# EasyEDA Pro project ProPrj_PomoDesk_V1.0.epro, schematic Schematic1_1

## Sheets
1 MAIN: Board Name: Board_USB_Only; Create Date: 2025-09-04; Page Name: MAIN; Project Name: Pomodoro_desk; Schematic Name: Schematic1_1; Update Date: 2026-05-01; Company: EasyEDA.com; Page Size: A4; Version: V1.0
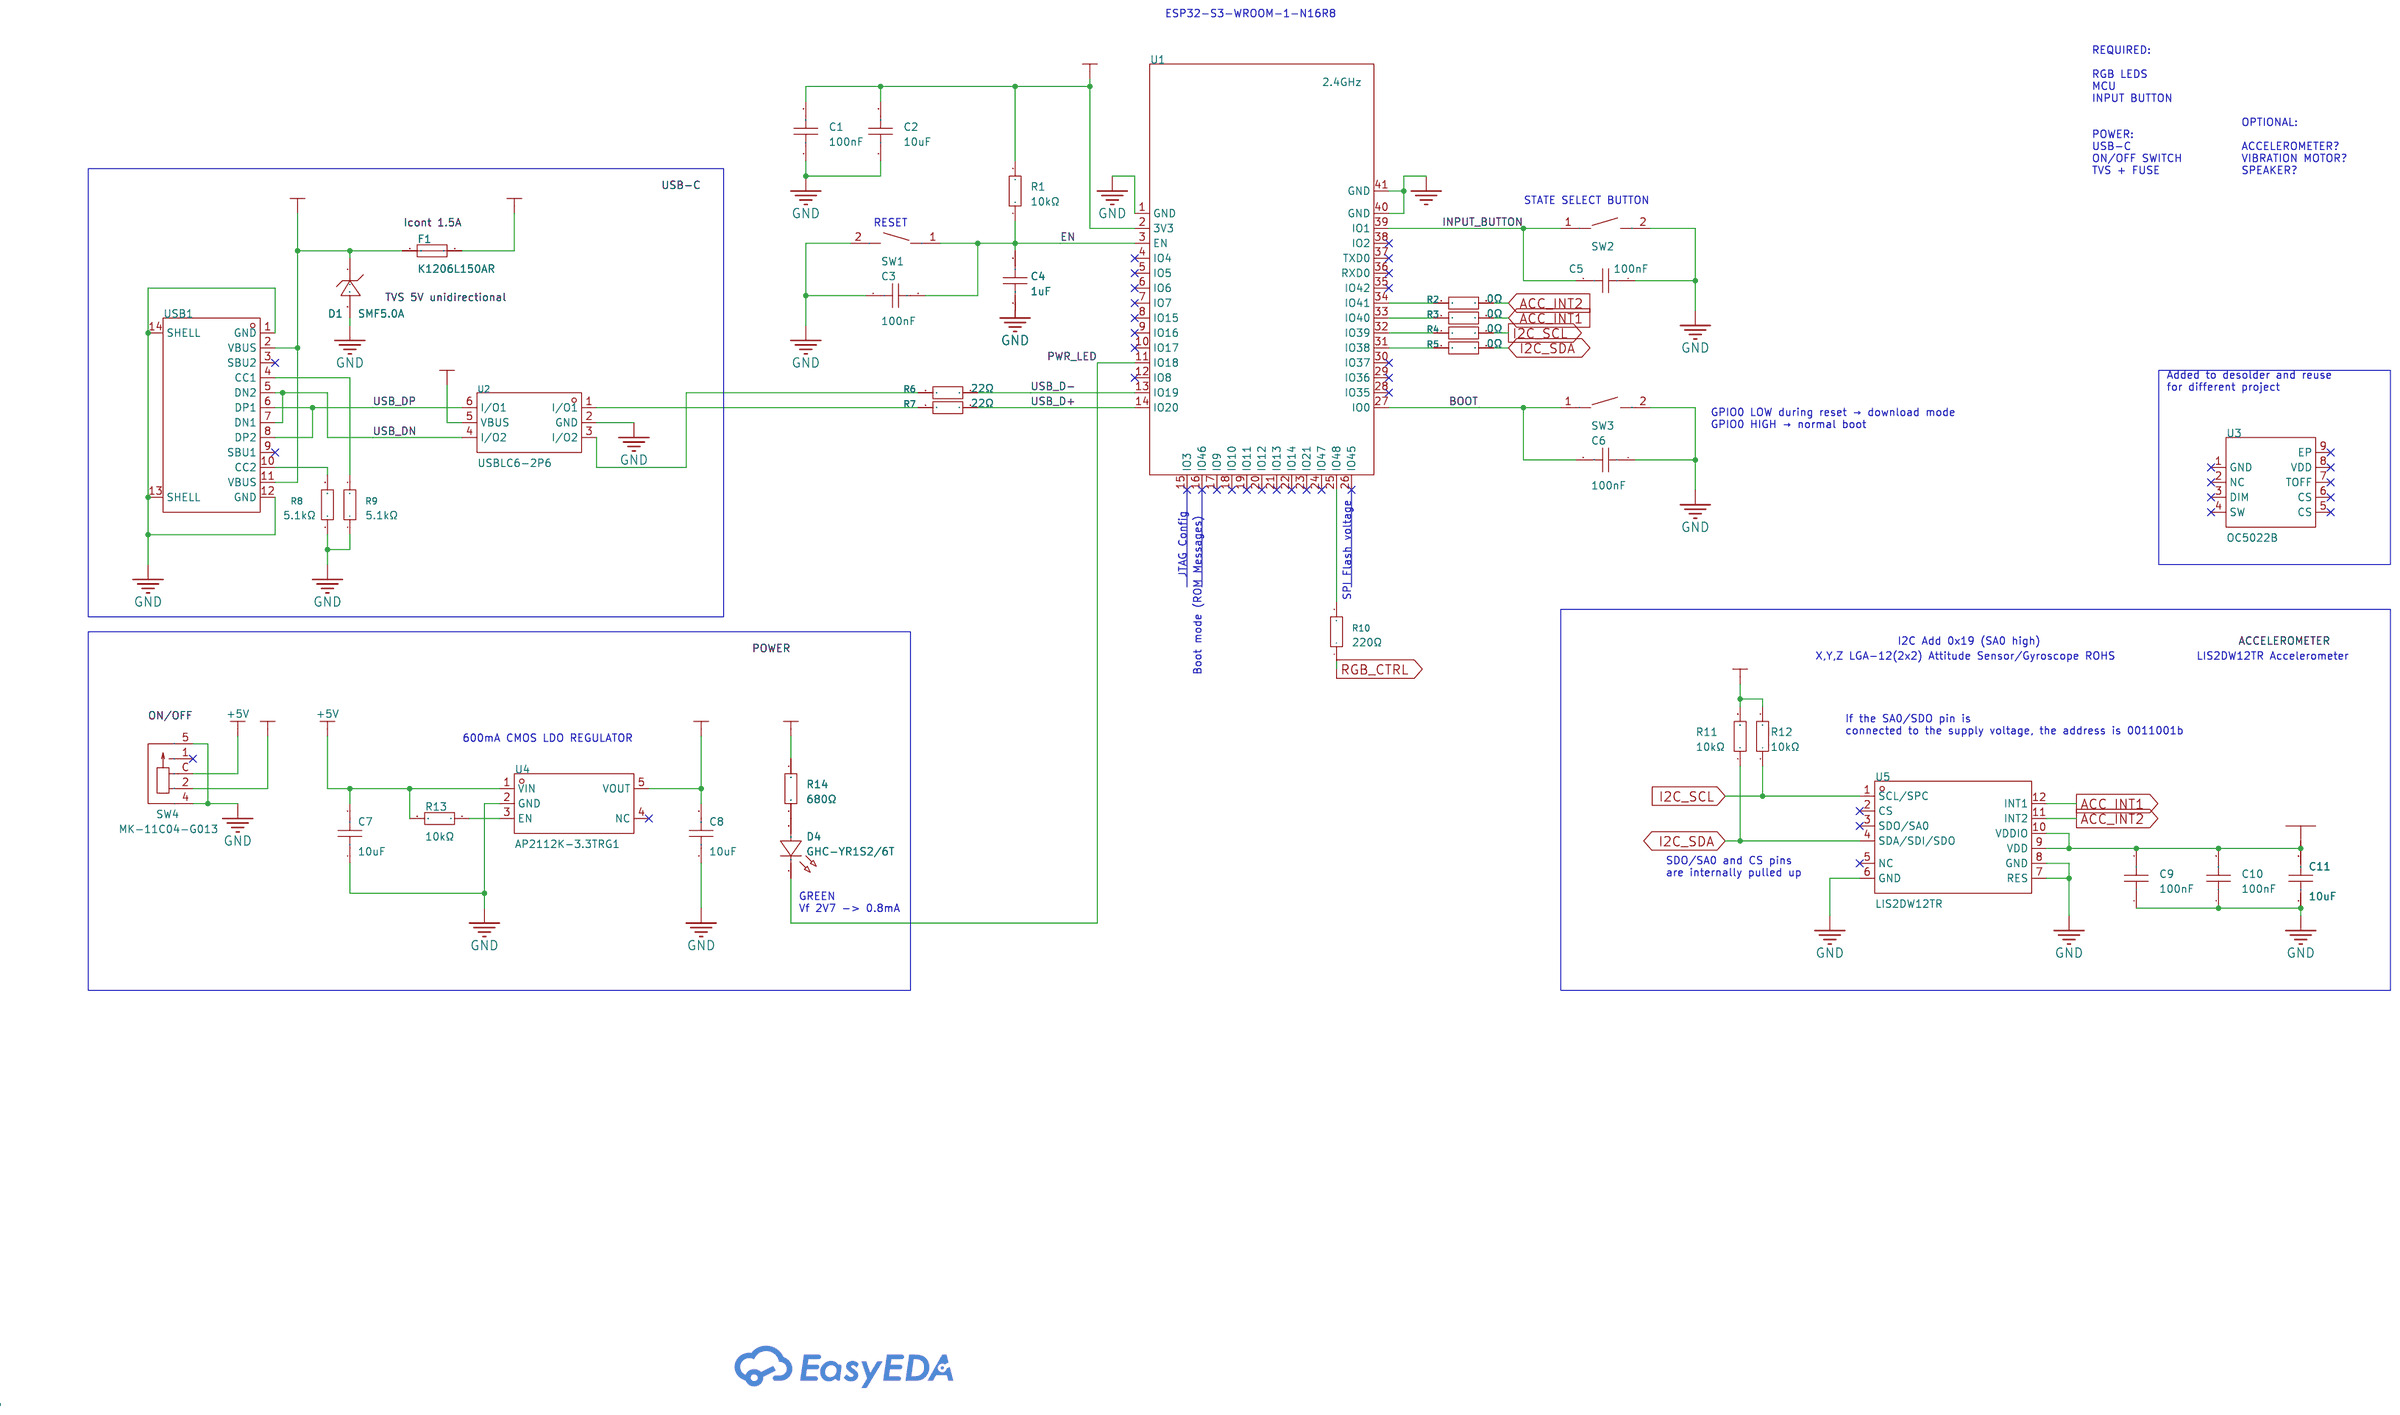
[diagram p3: MAIN]
2 LEDS: Page Name: LEDS; Update Date: 2026-04-30
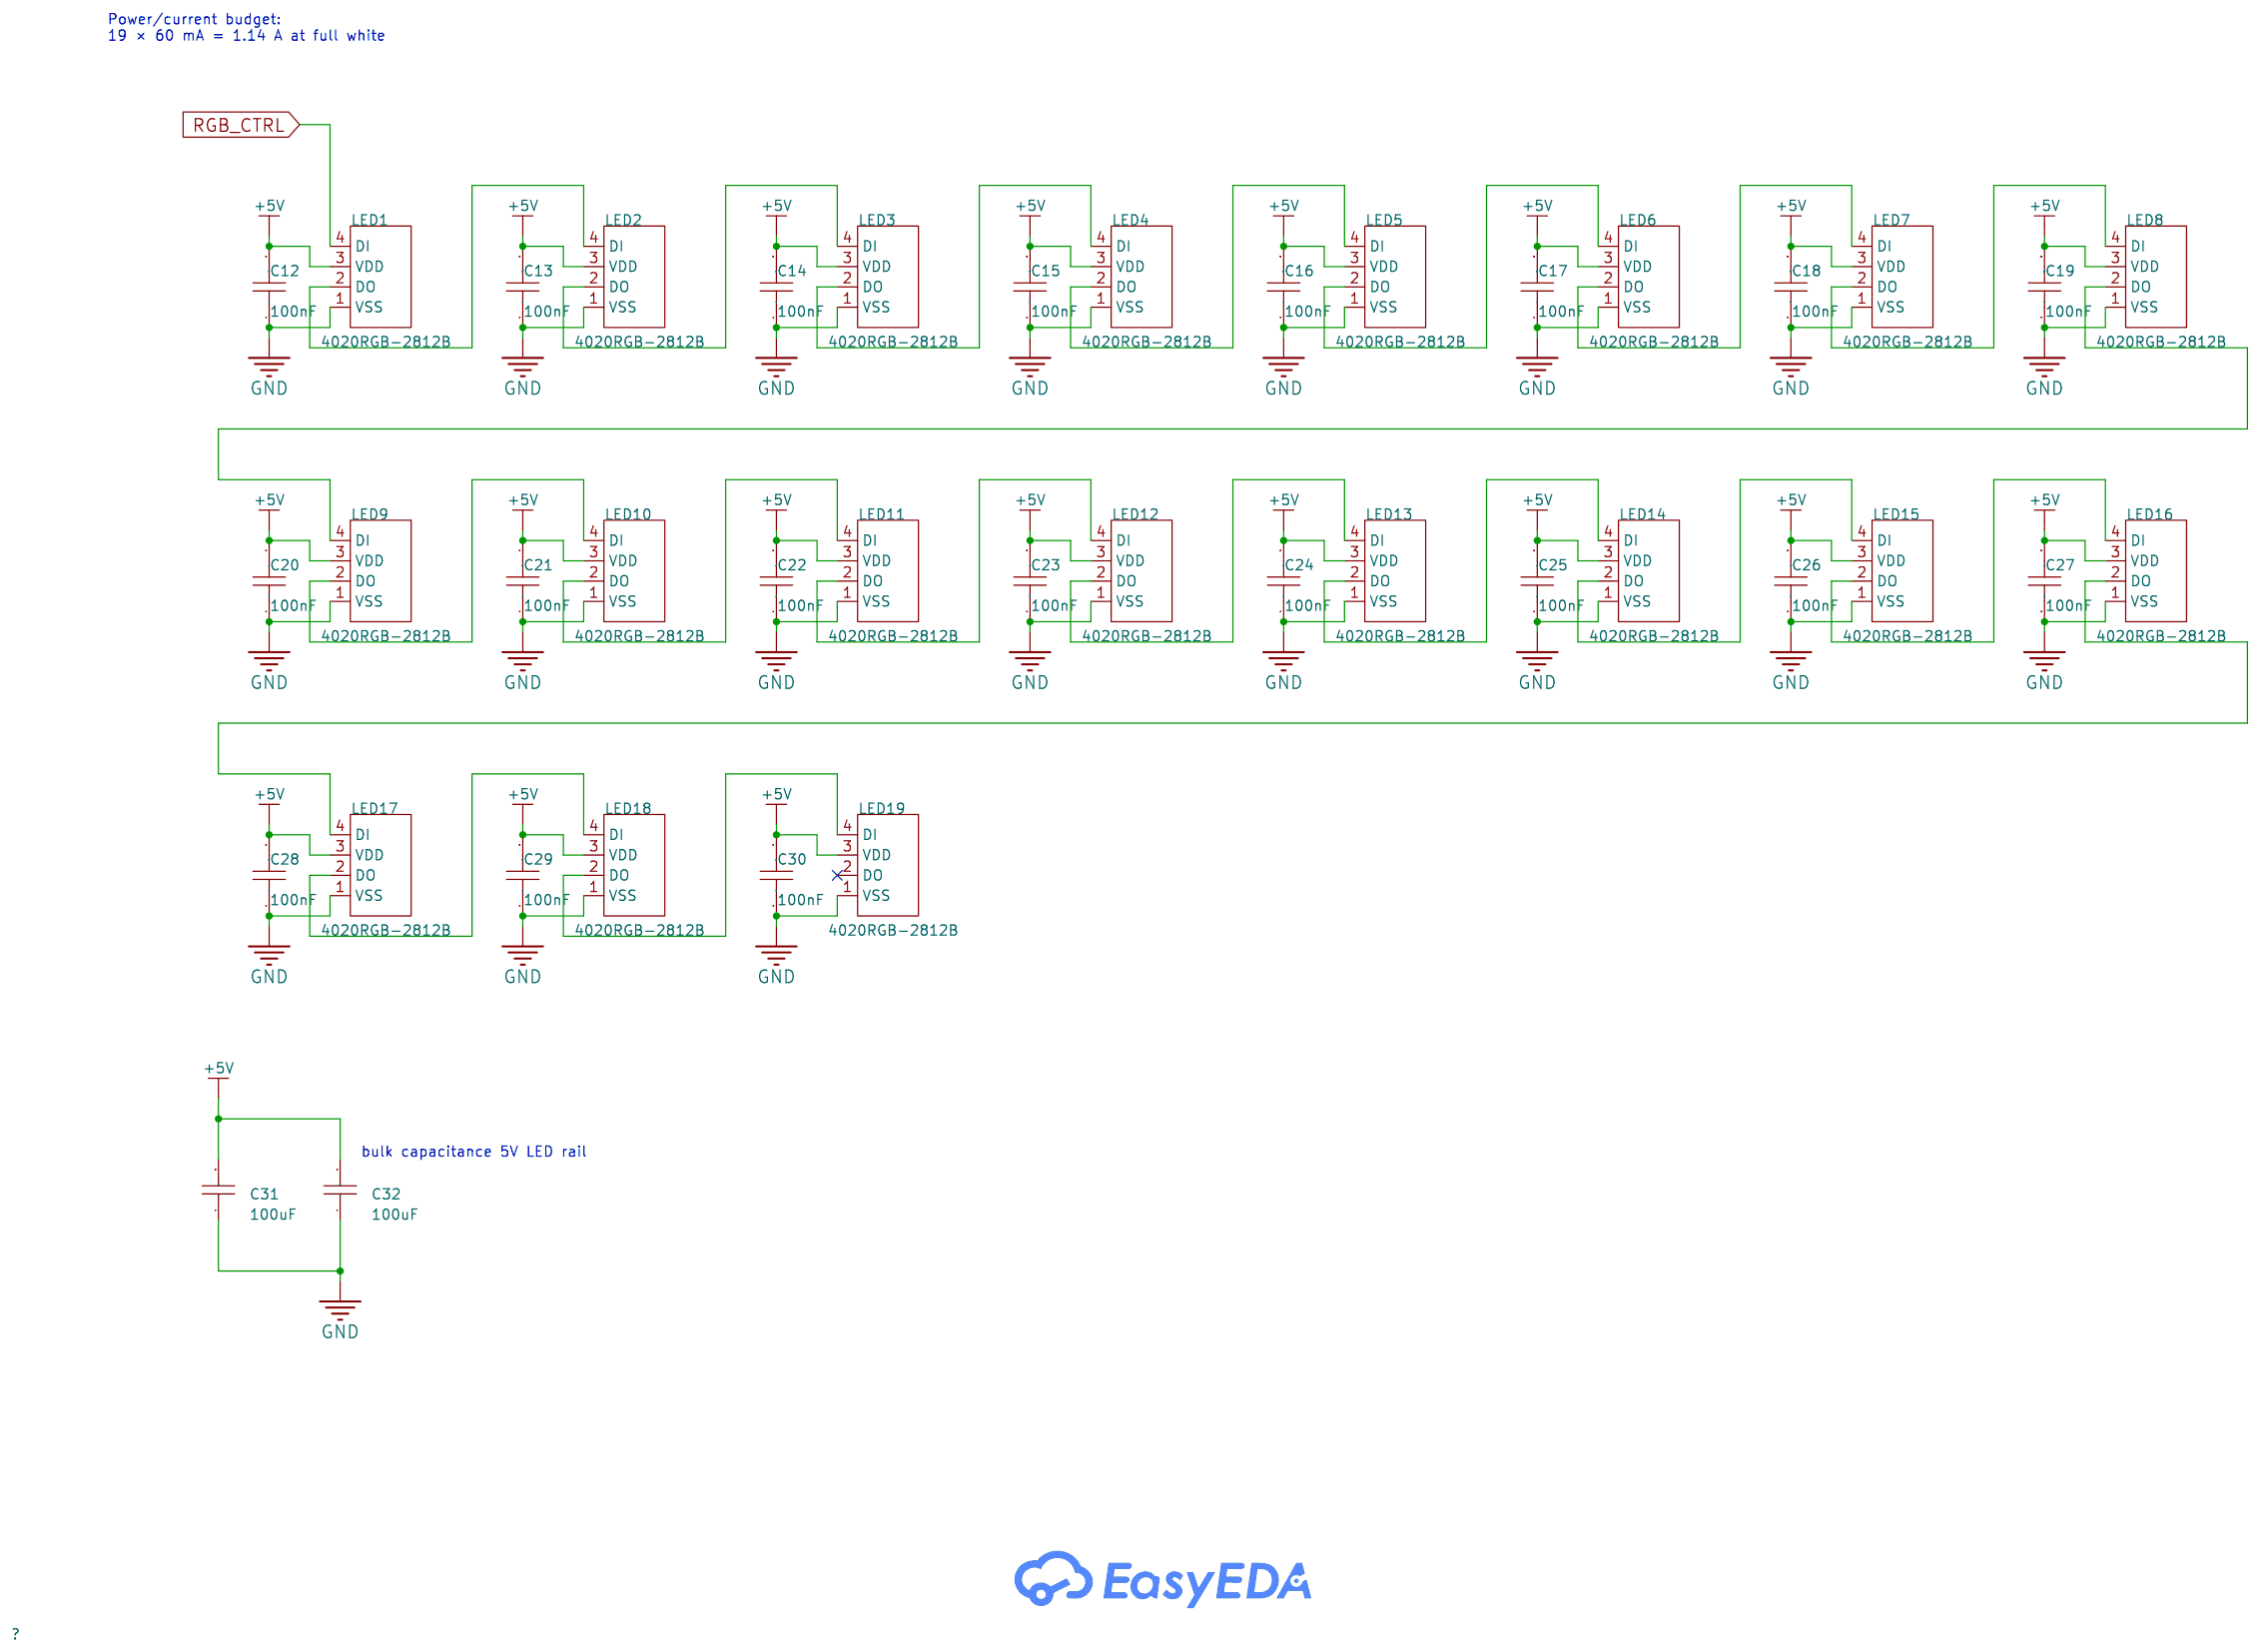
[diagram p4: LEDS]

## Parts
sheet LEDS
C12  100nF  [C0402]
C13  100nF  [C0402]
C14  100nF  [C0402]
C15  100nF  [C0402]
C16  100nF  [C0402]
C17  100nF  [C0402]
C18  100nF  [C0402]
C19  100nF  [C0402]
C20  100nF  [C0402]
C21  100nF  [C0402]
C22  100nF  [C0402]
C23  100nF  [C0402]
C24  100nF  [C0402]
C25  100nF  [C0402]
C26  100nF  [C0402]
C27  100nF  [C0402]
C28  100nF  [C0402]
C29  100nF  [C0402]
C30  100nF  [C0402]
C31  100uF  [C1206]
C32  100uF  [C1206]
LED1  4020RGB-2812B  [LED-SMD_4P-L4.0-W1.7_XL-4020RGBC-WS2812B]
LED2  4020RGB-2812B  [LED-SMD_4P-L4.0-W1.7_XL-4020RGBC-WS2812B]
LED3  4020RGB-2812B  [LED-SMD_4P-L4.0-W1.7_XL-4020RGBC-WS2812B]
LED4  4020RGB-2812B  [LED-SMD_4P-L4.0-W1.7_XL-4020RGBC-WS2812B]
LED5  4020RGB-2812B  [LED-SMD_4P-L4.0-W1.7_XL-4020RGBC-WS2812B]
LED6  4020RGB-2812B  [LED-SMD_4P-L4.0-W1.7_XL-4020RGBC-WS2812B]
LED7  4020RGB-2812B  [LED-SMD_4P-L4.0-W1.7_XL-4020RGBC-WS2812B]
LED8  4020RGB-2812B  [LED-SMD_4P-L4.0-W1.7_XL-4020RGBC-WS2812B]
LED9  4020RGB-2812B  [LED-SMD_4P-L4.0-W1.7_XL-4020RGBC-WS2812B]
LED10  4020RGB-2812B  [LED-SMD_4P-L4.0-W1.7_XL-4020RGBC-WS2812B]
LED11  4020RGB-2812B  [LED-SMD_4P-L4.0-W1.7_XL-4020RGBC-WS2812B]
LED12  4020RGB-2812B  [LED-SMD_4P-L4.0-W1.7_XL-4020RGBC-WS2812B]
LED13  4020RGB-2812B  [LED-SMD_4P-L4.0-W1.7_XL-4020RGBC-WS2812B]
LED14  4020RGB-2812B  [LED-SMD_4P-L4.0-W1.7_XL-4020RGBC-WS2812B]
LED15  4020RGB-2812B  [LED-SMD_4P-L4.0-W1.7_XL-4020RGBC-WS2812B]
LED16  4020RGB-2812B  [LED-SMD_4P-L4.0-W1.7_XL-4020RGBC-WS2812B]
LED17  4020RGB-2812B  [LED-SMD_4P-L4.0-W1.7_XL-4020RGBC-WS2812B]
LED18  4020RGB-2812B  [LED-SMD_4P-L4.0-W1.7_XL-4020RGBC-WS2812B]
LED19  4020RGB-2812B  [LED-SMD_4P-L4.0-W1.7_XL-4020RGBC-WS2812B]
sheet MAIN
C1  100nF  [C0402]
C2  10uF  [C0805]
C3  100nF  [C0402]
C4  1uF  [C0603]
C5  100nF  [C0402]
C6  100nF  [C0402]
C7  10uF  [C0805]
C8  10uF  [C0805]
C9  100nF  [C0402]
C10  100nF  [C0402]
C11  10uF  [C0805]
D1  SMF5.0A  [SOD-123F_L2.8-W1.8-LS3.7-RD]
D4  GHC-YR1S2/6T  [LED0603-RD_GREEN]
F1  K1206L150AR  [F1206]
R1  10kΩ  [R0402]
R2  0Ω  [R0402]
R3  0Ω  [R0402]
R4  0Ω  [R0402]
R5  0Ω  [R0402]
R6  22Ω  [R0402]
R7  22Ω  [R0402]
R8  5.1kΩ  [R0402]
R9  5.1kΩ  [R0402]
R10  220Ω  [R0402]
R11  10kΩ  [R0402]
R12  10kΩ  [R0402]
R13  10kΩ  [R0402]
R14  680Ω  [R0402]
SW1  TS-1088-AR02016  [SW-SMD_L3.9-W3.0-P4.45]
SW2  TS-1088-AR02016  [SW-SMD_L3.9-W3.0-P4.45]
SW3  TS-1088-AR02016  [SW-SMD_L3.9-W3.0-P4.45]
SW4  MK-11C04-G013  [SW-SMD_MK-11C04-G013]
U1  2.4GHz  [WIRELM-SMD_ESP32-S3-WROOM-1]
U2  USBLC6-2P6  [SOT-666-6_L1.6-W1.2-P0.50-LS1.6-BL]
U3  OC5022B  [ESOP-8_L4.9-W3.9-P1.27-LS6.0-BL-EP-1]
U4  AP2112K-3.3TRG1  [SOT-25-5_L2.9-W1.6-P0.95-LS2.8-BL]
U5  LIS2DW12TR  [LGA-12_L2.0-W2.0-P0.50-BL]
USB1  TYPE-C 16PIN 2MD(073)  [USB-C-SMD_TYPE-C-6PIN-2MD-073]

## Library data of the parts
C1 C3 C5 C6 C9 C10 C12-C30 = CL05B104KO5NNNC: Capacitance:100nF Tolerance:±10% Tolerance:±10% Voltage Rating:16V Temperature Coefficient:X7R; LCSC Part Name: 100nF ±10% 16V; Supplier Part: C1525; Manufacturer: SAMSUNG(三星); Supplier Footprint: 0402; JLCPCB Part Class: Basic Part; Datasheet: https://item.szlcsc.com/datasheet/CL05B104KO5NNNC/1877.html; Supplier: LCSC; Tolerance: ±10%; Voltage Rating: 16V; Temperature Coefficient: X7R
C31 C32 = CL31A107MQHNNNE: Capacitance:100uF Tolerance:±20% Tolerance:±20% Voltage Rating:6.3V Temperature Coefficient:X5R; LCSC Part Name: 100uF ±20% 6.3V; Supplier Part: C15008; Manufacturer: SAMSUNG(三星); Supplier Footprint: 1206; JLCPCB Part Class: Basic Part; Datasheet: https://item.szlcsc.com/datasheet/CL31A107MQHNNNE/15681.html; Supplier: LCSC; Tolerance: ±20%; Voltage Rating: 6.3V; Temperature Coefficient: X5R
LED1-LED19 = XL-4020RGBC-2812B: Wavelength:B:465nm~475nm；R:620nm~630nm；G:515nm~525nm Luminous Intensity:G:600mcd~800mcd；R:200mcd~300mcd；B:100mcd~200mcd Fixed-Frequency Pwm Mode:1.5kHz Data Transmission Rate:800Kbit/s Voltage - Supply:4.5V~5.5V Voltage - Supply:4.5V~5.5V Quiescent Curren; LCSC Part Name: XL-4020RGBC-WS2812B; Supplier Part: C3647024; Manufacturer: XINGLIGHT(成兴光); Supplier Footprint: SMD-4P,4x2mm; JLCPCB Part Class: Extended Part; Datasheet: https://item.szlcsc.com/datasheet/XL-4020RGBC-2812B/4213939.html; Supplier: LCSC; Wavelength: B:465nm~475nm；R:620nm~630nm；G:515nm~525nm; Luminous Intensity: G:600mcd~800mcd；R:200mcd~300mcd；B:100mcd~200mcd; Fixed-Frequency Pwm Mode: 1.5kHz; Data Transmission Rate: 800Kbit/s; Voltage - Supply: 4.5V~5.5V; Lens Color: Water Clear; ESD Withstand Voltage: 2000V; Installation method: Side View Mount; Operating Temperature: -20℃~+85℃; Peak Wavelength: R:625nm；B:470nm；G:525nm; Viewing Angle: 120°; Length: 3.95mm; Width: 1.7mm; Height: 1.95mm
C2 C7 C8 C11 = CL21A106KAYNNNE_C15850: Capacitance:10uF Tolerance:±10% Tolerance:±10% Voltage Rating:25V Temperature Coefficient:X5R; LCSC Part Name: 10uF ±10% 25V; Supplier Part: C15850; Manufacturer: SAMSUNG(三星); Manufacturer Part: CL21A106KAYNNNE; Supplier Footprint: 0805; JLCPCB Part Class: Basic Part; Datasheet: https://item.szlcsc.com/datasheet/CL21A106KAYNNNE/16532.html; Supplier: LCSC; Tolerance: ±10%; Voltage Rating: 25V; Temperature Coefficient: X5R
C4 = CL10A105KB8NNNC: Capacitance:1uF Tolerance:±10% Tolerance:±10% Voltage Rating:50V Temperature Coefficient:X5R; LCSC Part Name: 1uF ±10% 50V; Supplier Part: C15849; Manufacturer: SAMSUNG(三星); Supplier Footprint: 0603; JLCPCB Part Class: Basic Part; Datasheet: https://item.szlcsc.com/datasheet/CL10A105KB8NNNC/16531.html; Supplier: LCSC; Tolerance: ±10%; Voltage Rating: 50V; Temperature Coefficient: X5R
D1 = SMF5.0A_C151296: Reverse Stand-Off Voltage (Vrwm):5V Maximum Clamping Voltage:9.2V Peak Pulse Current (Ipp)@10/1000us:21.7A Peak Pulse Power Dissipation (Ppp)@10/1000us:200W Breakdown Voltage:6.4V Type:TVS; Supplier Part: C151296; Manufacturer: Littelfuse(美国力特); Supplier Footprint: SOD-123; JLCPCB Part Class: Extended Part; Datasheet: https://atta.szlcsc.com/upload/public/pdf/source/20171201/C151298_15121179413071156555.pdf; Supplier: LCSC; Reverse Stand-Off Voltage (Vrwm): 5V; Maximum Clamping Voltage: 9.2V; Peak Pulse Current (Ipp)@10/1000us: 21.7A; Peak Pulse Power Dissipation (Ppp)@10/1000us: 200W; Breakdown Voltage: 6.4V; Type: TVS
D4 = 19-217/GHC-YR1S2/6T: LCSC Part Name: 翠绿; Supplier Part: C2986059; Manufacturer: EVERLIGHT(亿光); Supplier Footprint: 0603; JLCPCB Part Class: Extended Part; Datasheet: https://atta.szlcsc.com/upload/public/pdf/source/20220705/5270194960AA522E2931401D212035CB.pdf; Supplier: LCSC
F1 = K1206L150AR: Voltage - Max:6V Current - Max:100A Hold Current:1.5A Trip Current:3A Power Dissipation:600mW Resistance - Initial (Ri) (Min):30mΩ Resistance - Post Trip (R1) (Max):170mΩ Time to Trip(Max):300ms Operating Temperature:-40℃~+85℃ Operating Temperature:-40℃~+; LCSC Part Name: 6V 1.5A 1206自恢复; Supplier Part: C2892425; Manufacturer: KUU; Supplier Footprint: 1206; JLCPCB Part Class: Extended Part; Datasheet: https://item.szlcsc.com/datasheet/K1206L150AR/3124044.html; Supplier: LCSC; Voltage - Max: 6V; Current - Max: 100A; Hold Current: 1.5A; Trip Current: 3A; Power Dissipation: 600mW; Resistance - Initial (Ri) (Min): 30mΩ; Resistance - Post Trip (R1) (Max): 170mΩ; Time to Trip(Max): 300ms; Operating Temperature: -40℃~+85℃; Length: 3.4mm; Width: 1.8mm; Height: 1mm
R1 R11-R13 = 0402WGF1002TCE: Type:Thick Film Resistors Resistance:10kΩ Tolerance:±1% Tolerance:±1% Power(Watts): Overload Voltage (Max): Temperature Coefficient:±100ppm/℃ Temperature Coefficient:±100ppm/℃ Operating Temperature Range:-55℃~+155℃ Operating Temperature Range:-55℃~+155℃; LCSC Part Name: 10kΩ ±1% 62.5mW 厚膜电阻; Supplier Part: C25744; Manufacturer: UNI-ROYAL(厚声); Supplier Footprint: 0402; JLCPCB Part Class: Basic Part; Datasheet: https://atta.szlcsc.com/upload/public/pdf/source/20200306/C422600_1E6D84923E4A46A82E41ADD87F860B5C.pdf; Supplier: LCSC; Type: Thick Film Resistors; Tolerance: ±1%; Temperature Coefficient: ±100ppm/℃; Operating Temperature Range: -55℃~+155℃
R2-R5 = 0402WGF0000TCE: Type:Thick Film Resistor Resistance:0Ω Tolerance:±1% Tolerance:±1% Power(Watts):62.5mW Voltage-Supply(Max):50V Temperature Coefficient:±800ppm/℃ Temperature Coefficient:±800ppm/℃ Operating Temperature:-55℃~+155℃ Operating Temperature:-55℃~+155℃; LCSC Part Name: 0Ω ±1% 62.5mW 厚膜电阻; Supplier Part: C17168; Manufacturer: UNI-ROYAL(厚声); Supplier Footprint: 0402; JLCPCB Part Class: Basic Part; Datasheet: https://item.szlcsc.com/datasheet/0402WGF0000TCE/17853.html; Supplier: LCSC; Type: Thick Film Resistor; Tolerance: ±1%; Power(Watts): 62.5mW; Voltage-Supply(Max): 50V; Temperature Coefficient: ±800ppm/℃; Operating Temperature: -55℃~+155℃
R6 R7 = 0402WGF220JTCE: Type:Thick Film Resistors Resistance:22Ω Tolerance:±1% Tolerance:±1% Power(Watts): Overload Voltage (Max): Temperature Coefficient:±100ppm/℃ Temperature Coefficient:±100ppm/℃ Operating Temperature Range:-55℃~+155℃ Operating Temperature Range:-55℃~+155℃; LCSC Part Name: 22Ω ±1% 62.5mW 厚膜电阻; Supplier Part: C25092; Manufacturer: UNI-ROYAL(厚声); Supplier Footprint: 0402; JLCPCB Part Class: Basic Part; Datasheet: https://atta.szlcsc.com/upload/public/pdf/source/20200306/C422600_1E6D84923E4A46A82E41ADD87F860B5C.pdf; Supplier: LCSC; Type: Thick Film Resistors; Tolerance: ±1%; Temperature Coefficient: ±100ppm/℃; Operating Temperature Range: -55℃~+155℃
R8 R9 = 0402WGF5101TCE: Type:Thick Film Resistors Resistance:5.1kΩ Tolerance:±1% Tolerance:±1% Power(Watts): Overload Voltage (Max): Temperature Coefficient:±100ppm/℃ Temperature Coefficient:±100ppm/℃ Operating Temperature Range:-55℃~+155℃ Operating Temperature Range:-55℃~+155℃; LCSC Part Name: 5.1kΩ ±1% 62.5mW 厚膜电阻; Supplier Part: C25905; Manufacturer: UNI-ROYAL(厚声); Supplier Footprint: 0402; JLCPCB Part Class: Basic Part; Datasheet: https://atta.szlcsc.com/upload/public/pdf/source/20200306/C422600_1E6D84923E4A46A82E41ADD87F860B5C.pdf; Supplier: LCSC; Type: Thick Film Resistors; Tolerance: ±1%; Temperature Coefficient: ±100ppm/℃; Operating Temperature Range: -55℃~+155℃
R10 = 0402WGF2200TCE: Type:Thick Film Resistor Resistance:220Ω Tolerance:±1% Tolerance:±1% Power(Watts):62.5mW Voltage-Supply(Max):50V Temperature Coefficient:±100ppm/℃ Temperature Coefficient:±100ppm/℃ Operating Temperature:-55℃~+155℃ Operating Temperature:-55℃~+155℃; LCSC Part Name: 220Ω ±1% 62.5mW 厚膜电阻; Supplier Part: C25091; Manufacturer: UNI-ROYAL(厚声); Supplier Footprint: 0402; JLCPCB Part Class: Basic Part; Datasheet: https://item.szlcsc.com/datasheet/0402WGF2200TCE/25834.html; Supplier: LCSC; Type: Thick Film Resistor; Tolerance: ±1%; Power(Watts): 62.5mW; Voltage-Supply(Max): 50V; Temperature Coefficient: ±100ppm/℃; Operating Temperature: -55℃~+155℃
R14 = 0402WGF6800TCE: Type:Thick Film Resistors Resistance: Tolerance:±1% Tolerance:±1% Power(Watts): Overload Voltage (Max): Temperature Coefficient:±100ppm/℃ Temperature Coefficient:±100ppm/℃ Operating Temperature Range:-55℃~+155℃ Operating Temperature Range:-55℃~+155℃; LCSC Part Name: 680Ω ±1% 62.5mW 厚膜电阻; Supplier Part: C25130; Manufacturer: UNI-ROYAL(厚声); Supplier Footprint: 0402; JLCPCB Part Class: Extended Part; Datasheet: https://atta.szlcsc.com/upload/public/pdf/source/20200306/C422600_1E6D84923E4A46A82E41ADD87F860B5C.pdf; Supplier: LCSC; Type: Thick Film Resistors; Tolerance: ±1%; Temperature Coefficient: ±100ppm/℃; Operating Temperature Range: -55℃~+155℃
SW1-SW3 = TS-1088-AR02016: Circuit:SPST Actuator Style:Round Button Operating Force:160gf Mounting Style:Brick nogging Switch Length:4mm Switch Width:3mm Switch Height:2mm Strike Gundam:不带 Contact Current:50mA Voltage Rating (DC):12V Insulation Resistance:100MΩ Actuator/Cap Color:B; LCSC Part Name: 4*3*2mm 立贴 轻触开关; Supplier Part: C720477; Manufacturer: XUNPU(讯普); Supplier Footprint: SMD; JLCPCB Part Class: Extended Part; Datasheet: https://atta.szlcsc.com/upload/public/pdf/source/20200810/C720475_60D09DD6C54279ADDB2DC25100F1CC11.pdf; Supplier: LCSC; Circuit: SPST; Actuator Style: Round Button; Operating Force: 160gf; Mounting Style: Brick nogging; Switch Length: 4mm; Switch Width: 3mm; Switch Height: 2mm; Strike Gundam: 不带; Contact Current: 50mA; Voltage Rating (DC): 12V; Insulation Resistance: 100MΩ; Actuator/Cap Color: Black; Pin Style: SMDSplicing; Mechanical Life: 10万次; Operating Temperature: -30℃~+80℃
SW4 = MK-11C04-G013: Circuit:SPDT Actuator Style:Rectangular Columnar Termination Style:J-Lead Length:5.5mm Width:0.7mm Switch Height:3.8mm Mounting Type:Surface Mount, Right Angle Actuator Color:Black Current Rating:1A Voltage Rating:6V Life:10,000 Cycles Operating Temperatu; LCSC Part Name: 1P2T超小型拨动开关; Supplier Part: C778185; Manufacturer: G-Switch(品赞); Supplier Footprint: SMD,5.5x0.7mm; JLCPCB Part Class: Extended Part; Datasheet: https://item.szlcsc.com/datasheet/MK-11C04-G013/826786.html; Supplier: LCSC; Circuit: SPDT; Actuator Style: Rectangular Columnar; Termination Style: J-Lead; Length: 5.5mm; Width: 0.7mm; Switch Height: 3.8mm; Mounting Type: Surface Mount, Right Angle; Actuator Color: Black; Current Rating: 1A; Voltage Rating: 6V; Life: 10,000 Cycles; Operating Temperature: -20℃~+70℃
U1 = ESP32-S3-WROOM-1-N16R8: Utilized IC / Part:ESP32-S3R8 Interface Type:I2C；GPIO；UART；SPI；USB；I2S Frequency:2.4GHz Antenna Type:On-board PCB Antenna Output Power:20.5dBm Output Power:20.5dBm Voltage - Supply:3V~3.6V Voltage - Supply:3V~3.6V Receive  Current:95mA Send  Current:355mA; LCSC Part Name: 不带固件 通用型Wi-Fi+低功耗蓝牙MCU模组; Supplier Part: C2913202; Manufacturer: ESPRESSIF(乐鑫); Supplier Footprint: SMD,25.5x18mm; JLCPCB Part Class: Extended Part; Datasheet: https://item.szlcsc.com/datasheet/ESP32-S3-WROOM-1-N16R8/3198300.html; Supplier: LCSC; Utilized IC / Part: ESP32-S3R8; Interface Type: I2C；GPIO；UART；SPI；USB；I2S; Antenna Type: On-board PCB Antenna; Output Power: 20.5dBm; Voltage - Supply: 3V~3.6V; Receive  Current: 95mA; Send  Current: 355mA; Sensitivity: -103.5dBm; Operating Temperature: -40℃~+65℃
U2 = USBLC6-2P6: Type:ESD; LCSC Part Name: MSL=3; Supplier Part: C2827693; Manufacturer: TECH PUBLIC(台舟); Supplier Footprint: SOT-666-6; JLCPCB Part Class: Extended Part; Datasheet: https://atta.szlcsc.com/upload/public/pdf/source/20210810/36353A9194EA9F4E33F8AE18BE051AEA.pdf; Supplier: LCSC; Type: ESD
U3 = OC5022B: Type:- Voltage - Input(DC):3.1V~60V Voltage - Input(DC):3.1V~60V Frequency - Switching:1MHz Frequency - Switching:1MHz Number of Channels:1 Output Voltage:- Output Voltage:- Output Current:- Dimming:PWM Features:Over-Temperature Protection (OTP) Voltage -; LCSC Part Name: 内置MOS开关降压型LED恒流驱动器; Supplier Part: C842718; Manufacturer: OCX(欧创芯); Supplier Footprint: ESOP-8; JLCPCB Part Class: Extended Part; Datasheet: https://item.szlcsc.com/datasheet/OC5022B/901261.html; Supplier: LCSC; Voltage - Input(DC): 3.1V~60V; Frequency - Switching: 1MHz; Number of Channels: 1; Dimming: PWM; Features: Over-Temperature Protection (OTP); Topology: Buck; Operating temperature: -20℃~+85℃; Switch Tube (Built-In/External): Built-in
U4 = AP2112K-3.3TRG1: Output Type:Fixed Voltage - Supply:6V Output Voltage:3.3V Output Voltage:3.3V Output Current:600mA Power Supply Rejection Ratio (PSRR):65dB@(1kHz) Voltage Dropout:250mV@(600mA) standby current:55uA Noise:50uVrms Features:Enable；Over Temperature Protection; LCSC Part Name: 输入6V 输出3.3V 600mA; Supplier Part: C51118; Manufacturer: DIODES(美台); Supplier Footprint: SOT-25-5; JLCPCB Part Class: Extended Part; Datasheet: https://item.szlcsc.com/datasheet/AP2112K-3.3TRG1/52131.html; Supplier: LCSC; Output Type: Fixed; Voltage - Supply: 6V; Output Voltage: 3.3V; Output Current: 600mA; Power Supply Rejection Ratio (PSRR): 65dB@(1kHz); Voltage Dropout: 250mV@(600mA); standby current: 55uA; Noise: 50uVrms; Features: Enable；Over Temperature Protection；Over Current Protection; Operating Temperature: -40℃~+85℃@(Ta); Output Configuration: Positive; Number of Outputs: 1
U5 = LIS2DW12TR: Axial Direction:X,Y,Z Supply Voltage:1.62V~3.6V Supply Voltage:1.62V~3.6V Operating Temperature:-40℃~+85℃ Operating Temperature:-40℃~+85℃; Supplier Part: C189624; Manufacturer: ST(意法半导体); Supplier Footprint: LGA-12(2x2); JLCPCB Part Class: Extended Part; Datasheet: https://atta.szlcsc.com/upload/public/pdf/source/20180403/C189624_150963097ED842400E055DE40577DCB1.pdf; Supplier: LCSC; Axial Direction: X,Y,Z; Supply Voltage: 1.62V~3.6V; Operating Temperature: -40℃~+85℃
USB1 = TYPE-C 16PIN 2MD(073): Connector Type:Type-C Protocol Standard:- Gender:Female Mounting Type:Surface Mount, Right Angle Number of Contacts:16P Number of Ports:1 Current Rating-Power:3A Voltage Rating:5V Connect-Disconnect Life:5,000 Cycles Supplementary Features:- Center Height; LCSC Part Name: Type-C 母 卧贴; Supplier Part: C2765186; Manufacturer: SHOU HAN(首韩); Supplier Footprint: SMD; JLCPCB Part Class: Extended Part; Datasheet: https://item.szlcsc.com/datasheet/TYPE-C%252016PIN%25202MD(073)/2901843.html; Supplier: LCSC; Connector Type: Type-C; Gender: Female; Mounting Type: Surface Mount, Right Angle; Number of Contacts: 16P; Number of Ports: 1; Current Rating-Power: 3A; Voltage Rating: 5V; Connect-Disconnect Life: 5,000 Cycles; Detection color: Black; Operating Temperature: -25℃~+85℃

## Nets
+3V3: C1.2 C2.2 C8.2 C9.2 C10.2 C11.2 R1.2 R11.2 R12.2 R14.2 U1.2(3V3) U4.5(VOUT) U5.9(VDD) U5.10(VDDIO)
+5V: C7.2 C12.2 C13.2 C14.2 C15.2 C16.2 C17.2 C18.2 C19.2 C20.2 C21.2 C22.2 C23.2 C24.2 C25.2 C26.2 C27.2 C28.2 C29.2 C30.2 C31.2 C32.2 LED1.3(VDD) LED2.3(VDD) LED3.3(VDD) LED4.3(VDD) LED5.3(VDD) LED6.3(VDD) LED7.3(VDD) LED8.3(VDD) LED9.3(VDD) LED10.3(VDD) LED11.3(VDD) LED12.3(VDD) LED13.3(VDD) LED14.3(VDD) LED15.3(VDD) LED16.3(VDD) LED17.3(VDD) LED18.3(VDD) LED19.3(VDD) R13.2 SW4.C U4.1(VIN)
GND: C1.1 C2.1 C3.1 C4.1 C5.1 C6.1 C7.1 C8.1 C9.1 C10.1 C11.1 C12.1 C13.1 C14.1 C15.1 C16.1 C17.1 C18.1 C19.1 C20.1 C21.1 C22.1 C23.1 C24.1 C25.1 C26.1 C27.1 C28.1 C29.1 C30.1 C31.1 C32.1 D1.2 LED1.1(VSS) LED2.1(VSS) LED3.1(VSS) LED4.1(VSS) LED5.1(VSS) LED6.1(VSS) LED7.1(VSS) LED8.1(VSS) LED9.1(VSS) LED10.1(VSS) LED11.1(VSS) LED12.1(VSS) LED13.1(VSS) LED14.1(VSS) LED15.1(VSS) LED16.1(VSS) LED17.1(VSS) LED18.1(VSS) LED19.1(VSS) R8.1 R9.1 SW1.2 SW2.2 SW3.2 SW4.4 SW4.5 U1.1(GND) U1.40(GND) U1.41(GND) U2.2(GND) U4.2(GND) U5.6(GND) U5.7(RES) U5.8(GND) USB1.1(GND) USB1.12(GND) USB1.13(SHELL) USB1.14(SHELL)
VBUS: D1.1 F1.1 U2.5(VBUS) USB1.2(VBUS) USB1.11(VBUS)
VIN: F1.2 SW4.2
ACC_INT1: R3.2 U5.12(INT1)
ACC_INT2: R2.2 U5.11(INT2)
BOOT: C6.2 SW3.1 U1.27(IO0)
EN: C3.2 C4.2 R1.1 SW1.1 U1.3(EN)
I2C_SCL: R4.2 R12.1 U5.1(SCL/SPC)
I2C_SDA: R5.2 R11.1 U5.4(SDA/SDI/SDO)
INPUT_BUTTON: C5.2 SW2.1 U1.39(IO1)
PWR_LED: D4.1(K) U1.11(IO18)
RGB_CTRL: LED1.4(DI) R10.1
USB_D+: R7.2 U1.14(IO20)
USB_D-: R6.2 U1.13(IO19)
USB_DN: U2.4(I/O2) USB1.5(DN2) USB1.7(DN1)
USB_DP: U2.6(I/O1) USB1.6(DP1) USB1.8(DP2)
$1N18730: R8.2 USB1.10(CC2)
$1N18731: R9.2 USB1.4(CC1)
$1N24247: R10.2 U1.25(IO48)
$1N24410: R3.1 U1.33(IO40)
$1N24494: R4.1 U1.32(IO39)
$1N24537: R5.1 U1.31(IO38)
$1N28130: R13.1 U4.3(EN)
$1N28194: R6.1 U2.3(I/O2)
$1N28239: R7.1 U2.1(I/O1)
$1N30261: R2.1 U1.34(IO41)
$1N32916: D4.2(A) R14.1
$2N12529: LED1.2(DO) LED2.4(DI)
$2N12799: LED2.2(DO) LED3.4(DI)
$2N13050: LED3.2(DO) LED4.4(DI)
$2N13066: LED4.2(DO) LED5.4(DI)
$2N13318: LED5.2(DO) LED6.4(DI)
$2N13334: LED6.2(DO) LED7.4(DI)
$2N13586: LED7.2(DO) LED8.4(DI)
$2N13602: LED8.2(DO) LED9.4(DI)
$2N14526: LED9.2(DO) LED10.4(DI)
$2N14542: LED10.2(DO) LED11.4(DI)
$2N14558: LED11.2(DO) LED12.4(DI)
$2N14574: LED12.2(DO) LED13.4(DI)
$2N14590: LED13.2(DO) LED14.4(DI)
$2N14606: LED14.2(DO) LED15.4(DI)
$2N14622: LED15.2(DO) LED16.4(DI)
$2N14638: LED16.2(DO) LED17.4(DI)
$2N15567: LED17.2(DO) LED18.4(DI)
$2N15583: LED18.2(DO) LED19.4(DI)

Not connected (* = marked no-connect by the designer): LED19 2(DO)*; SW4 1*; U1 4(IO4)* 5(IO5)* 6(IO6)* 7(IO7)* 8(IO15)* 9(IO16)* 10(IO17)* 12(IO8)* 15(IO3)* 16(IO46)* 17(IO9)* 18(IO10)* 19(IO11)* 20(IO12)* 21(IO13)* 22(IO14)* 23(IO21)* 24(IO47)* 26(IO45)* 28(IO35)* 29(IO36)* 30(IO37)* 35(IO42)* 36(RXD0)* 37(TXD0)* 38(IO2)*; U3 1(GND)* 2(NC)* 3(DIM)* 4(SW)* 5(CS)* 6(CS)* 7(TOFF)* 8(VDD)* 9(EP)*; U4 4(NC)*; U5 2(CS)* 3(SDO/SA0)* 5(NC)*; USB1 3(SBU2)* 9(SBU1)*

## Notes on the sheets
sheet 1
- ESP32-S3-WROOM-1-N16R8
- REQUIRED:
  RGB LEDS
  MCU
  INPUT BUTTON
  POWER:
  USB-C
  ON/OFF SWITCH
  TVS + FUSE
- OPTIONAL:
  ACCELEROMETER?
  VIBRATION MOTOR?
  SPEAKER?
- USB-C
- STATE SELECT BUTTON
- Icont 1.5A
- RESET
- TVS 5V unidirectional
- Added to desolder and reuse
  for different project
- GPIO0 LOW during reset → download mode
  GPIO0 HIGH → normal boot
- JTAG Config
- SPI Flash voltage
- POWER
- I2C Add 0x19 (SA0 high)
- ACCELEROMETER
- X,Y,Z LGA-12(2x2) Attitude Sensor/Gyroscope ROHS
- LIS2DW12TR Accelerometer
- Boot mode (ROM Messages)
- ON/OFF
- 600mA CMOS LDO REGULATOR
- If the SA0/SDO pin is
  connected to the supply voltage, the address is 0011001b
- SDO/SA0 and CS pins
  are internally pulled up
- GREEN
  Vf 2V7 -> 0.8mA
sheet 2
- Power/current budget:
  19 × 60 mA = 1.14 A at full white
- bulk capacitance 5V LED rail
